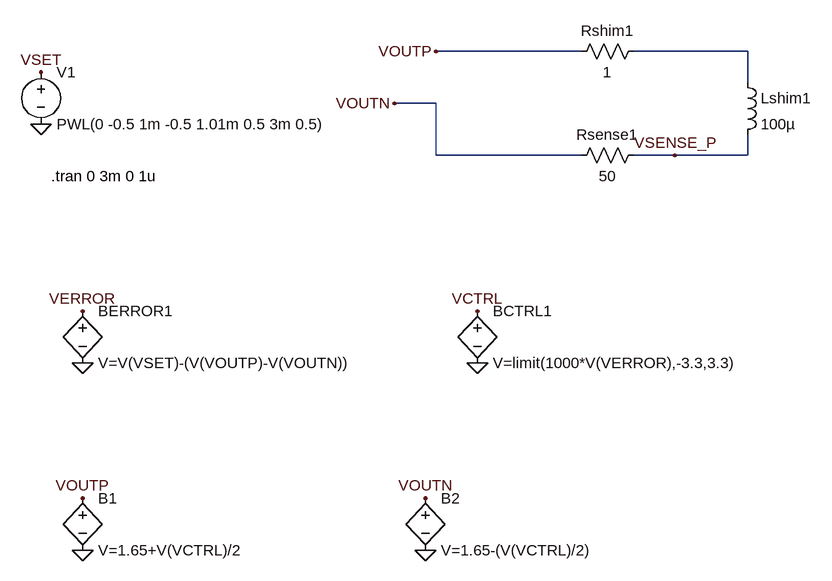
[diagram p0: schematic Draft3.asc]
Draft3.asc, the LTspice schematic file:
Version 4.1
SHEET 1 924 708
WIRE 560 -96 336 -96
WIRE 816 -96 640 -96
WIRE 816 -48 816 -96
WIRE 336 -16 272 -16
WIRE 336 64 336 -16
WIRE 560 64 336 64
WIRE 704 64 640 64
WIRE 816 64 816 32
WIRE 816 64 704 64
FLAG -272 -64 VSET
FLAG -272 16 0
FLAG 704 64 VSENSE_P
FLAG -208 304 VERROR
FLAG -208 384 0
FLAG 400 304 VCTRL
FLAG 400 384 0
FLAG -208 592 VOUTP
FLAG -208 672 0
FLAG 320 592 VOUTN
FLAG 320 672 0
FLAG 336 -96 VOUTP
FLAG 272 -16 VOUTN
SYMBOL ind 800 -64 R0
SYMATTR InstName Lshim1
SYMATTR Value 100µ
SYMBOL res 656 -112 R90
WINDOW 0 0 56 VBottom 2
WINDOW 3 32 56 VTop 2
SYMATTR InstName Rshim1
SYMATTR Value 1
SYMBOL res 656 48 R90
WINDOW 0 0 56 VBottom 2
WINDOW 3 32 56 VTop 2
SYMATTR InstName Rsense1
SYMATTR Value 50
SYMBOL bv -208 288 R0
SYMATTR InstName BERROR1
SYMATTR Value V=V(VSET)-(V(VOUTP)-V(VOUTN))
SYMBOL bv 400 288 R0
SYMATTR InstName BCTRL1
SYMATTR Value V=limit(1000*V(VERROR),-3.3,3.3)
SYMBOL voltage -272 -80 R0
SYMATTR InstName V1
SYMATTR Value PWL(0 -0.5 1m -0.5 1.01m 0.5 3m 0.5)
SYMBOL bv -208 576 R0
SYMATTR InstName B1
SYMATTR Value V=1.65+V(VCTRL)/2
SYMBOL bv 320 576 R0
SYMATTR InstName B2
SYMATTR Value V=1.65-(V(VCTRL)/2)
TEXT -256 96 Left 2 !.tran 0 3m 0 1u

The netlist it stands for:
* Draft3.asc
Lshim1 N001 VSENSE_P 100µ
Rshim1 N001 VOUTP 1
Rsense1 VSENSE_P VOUTN 50
BERROR1 VERROR 0 V=V(VSET)-(V(VOUTP)-V(VOUTN))
BCTRL1 VCTRL 0 V=limit(1000*V(VERROR),-3.3,3.3)
V1 VSET 0 PWL(0 -0.5 1m -0.5 1.01m 0.5 3m 0.5)
B1 VOUTP 0 V=1.65+V(VCTRL)/2
B2 VOUTN 0 V=1.65-(V(VCTRL)/2)
.tran 0 3m 0 1u
.backanno
.end

* Results of the author's LTspice run, read from the files saved beside the schematic
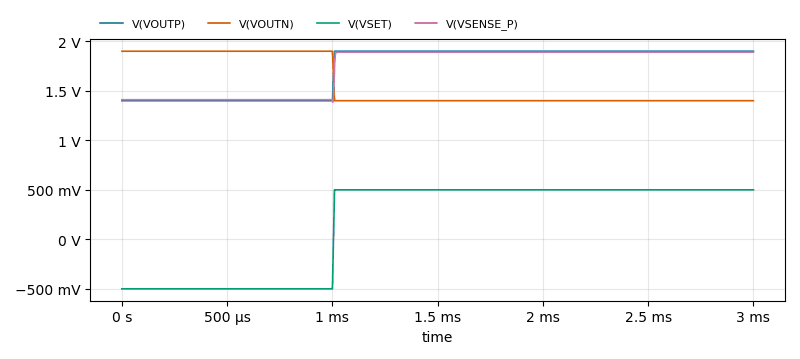
[diagram p1: Transient Analysis of Draft3.asc, plotted from the saved traces]
* Transient Analysis, 1 run:
*   V(VOUTP): min 1.4 V, max 1.9 V, average 1.732 V, rms 1.748 V, last 1.9 V
*   V(VOUTN): min 1.4 V, max 1.9 V, average 1.568 V, rms 1.585 V, last 1.4 V
*   V(VSET): min -500 mV, max 500 mV, average 165 mV, rms 499.5 mV, last 500 mV
*   V(VSENSE_P): min 1.384 V, max 1.89 V, average 1.729 V, rms 1.743 V, last 1.89 V